# Altium schematic sheet LED_Indicators.SchDoc
size A; SheetNumber: 4; SheetTotal: 4
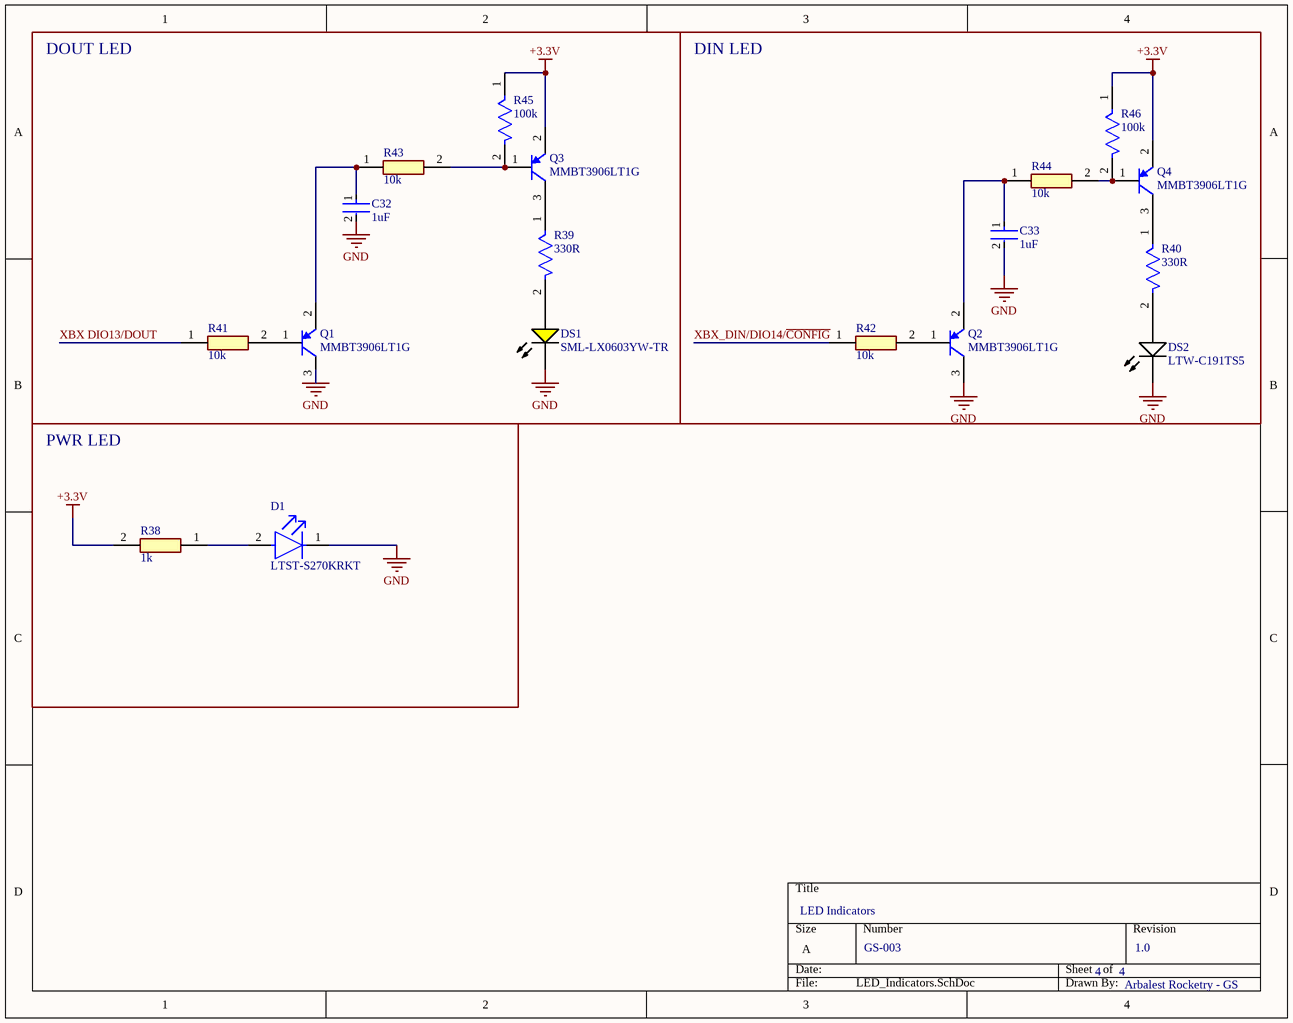
[diagram p0: LED_Indicators.SchDoc]

## Parts
C32  1uF  [FP-0603-L_1_6_0_1-W_0_8_0-IPC_A]
C33  1uF  [FP-0603-L_1_6_0_1-W_0_8_0-IPC_A]
D1  LTST-S270KRKT  [FP-LTST-S270KRKT-MFG]
DS1  SML-LX0603YW-TR  [LUMX-SML-LX0603_V]
DS2  LTW-C191TS5  [LTST-LTW-C191TS5_V]
Q1  MMBT3906LT1G  [ONSC-SOT-23-3-318-08_V]
Q2  MMBT3906LT1G  [ONSC-SOT-23-3-318-08_V]
Q3  MMBT3906LT1G  [ONSC-SOT-23-3-318-08_V]
Q4  MMBT3906LT1G  [ONSC-SOT-23-3-318-08_V]
R38  1k  [RESC1608X55N]
R39  330R  [FP-RMCF0603-MFG]
R40  330R  [FP-RMCF0603-MFG]
R41  10k  [RESC1608X55N]
R42  10k  [RESC1608X55N]
R43  10k  [RESC1608X55N]
R44  10k  [RESC1608X55N]
R45  100k  [FP-MCT0603-IPC_A]
R46  100k  [FP-MCT0603-IPC_A]

## Blocks framed on the sheet
DOUT LED: C32 DS1 Q1 Q3 R39 R41 R43 R45
DIN LED: C33 DS2 Q2 Q4 R40 R42 R44 R46
PWR LED: D1 R38

## Nets
+3.3V: Q3.2(E) Q4.2(E) R38.2 R45.1 R46.1
GND: C32.2 C33.2 D1.1(C) DS1.2(K) DS2.2(K) Q1.3(C) Q2.3(C)
XBX DIO13/DOUT: R41.1
XBX_DIN/DIO14/~{CONFIG}: R42.1
NetC32_1: C32.1 Q1.2(E) R43.1
NetC33_1: C33.1 Q2.2(E) R44.1
NetD1_2: D1.2(A) R38.1
NetDS1_1: DS1.1(A) R39.2
NetDS2_1: DS2.1(A) R40.2
NetQ1_1: Q1.1(B) R41.2
NetQ2_1: Q2.1(B) R42.2
NetQ3_1: Q3.1(B) R43.2 R45.2
NetQ3_3: Q3.3(C) R39.1
NetQ4_1: Q4.1(B) R44.2 R46.2
NetQ4_3: Q4.3(C) R40.1

## Notes on the sheet
- LED Indicators
- GS-003
- 4
- 1.0
- Arbalest Rocketry - GS

## Library data of the parts
C32 C33 = CMP-2000-07259-3: None; Voltage Rating (DC): 25V; Dielectric: X7R; Tolerance: 10%; Height: 0.8mm; Case Code (Metric): 1608; Max Operating Temperature: 125°C; Case Code (Imperial): 0603; Case/Package: 0603; Resistor Type: Ceramic; Halogen Free: Halogen Free; Capacitance: 1uF; Series: M; Voltage Rating: 25V; Number of Pins: 2; Depth: 0.8mm; RoHS Compliant: Yes; Mount: Surface Mount; Min Operating Temperature: -55°C; Length: 1.6mm; Contact Plating: Tin; Radiation Hardening: No; Width: 0.031inch; Construction: Flat; Thickness: 0.035inch; Packaging: Tape and Reel; Termination: SMD/SMT; REACH SVHC: No SVHC; Package Quantity: 1
D1 = CMP-2000-06630-2: LED RED CLEAR CHIP SMD R/A; Test Current: 20mA; Number of LEDs: 1; Power Rating: 75mW; Lens Style: Diffused; Luminous Intensity: 54mcd; Wavelength: 639nm; Dominant Wavelength: 631nm; Lens Color: Colorless; Forward Voltage: 2V; Viewing Angle: 130°; Forward Current: 30mA; Reverse Voltage: 5V; Illumination Color: Red; Case Code (Imperial): 0603; Color: Red; Packaging: Tape and Reel; Number of Pins: 2; Length: 1.6mm; Lens Transparency: Clear; Width: 1.15mm; Power Dissipation: 75mW; Lead Free: Lead Free; Max Power Dissipation: 75mW; Case/Package: 0603; Max Operating Temperature: 85°C; Mount: Surface Mount; Depth: 0.6mm; Number of Elements: 1; Radiation Hardening: No; Case Code (Metric): 1608; Package Quantity: 1; Height: 0.6mm; Min Operating Temperature: -55°C
DS1 = CMP-2000-07121-1: Yellow LED, Milky White Diffused Lens, 2.1 V, 14 mcd, -25 to 85 degC, 2-Pin SMD, RoHS, Tape and Reel; Manufacturer: Lumex; COO: CN; Number of LEDs: 1; Type: Uni-Color; Intensity: 14mcd; Reverse Voltage: 5(Min)V; LED Material: GaAsP; Viewing Angle: 160; Peak Wavelength: 585nm; Pin_Count: 2; Lens Appearance: ColorlessDiffused; Operating Temperature: -25to85C; Color: Yellow; Mounting Technology: SurfaceMount; Package Description: 2-Pin Surface Mount Device, Body 1.6 x 0.8 mm; Mounting: SurfaceMount; Packaging: TapeandReel; RoHS: Unknown; Supplier_Package: SMD; Package Reference: SML-LX00603; Part No: SML-LX0603YW-TR; Datasheet URL: http://www.lumex.com/content/files/ProductAttachment/SML-LX0603YW-TR.pdf; Dimension: 1.6x0.8x0.6mm; Manufacturer URL: http://www.lumexinstruments.com/; HTS: 8541402000; Datasheet Version: Rev. G, 09/2013; Lens Dimensions: 1x0.8x0.3mm; Dominant Wavelength: N/A; ECCN: EARII; Supplier: Lumex; Family: SML-LX0603YW
DS2 = CMP-1674-00013-1: LED Uni-Color White, 70 mW, 20 mA, -20 to 80 degC, 2-Pin SMD, RoHS, Tape and Reel; Case\Package: 0603; Power Rating: 100 mW; Voltage Rating: 50 V; Tolerance: 1%; Resistance: 12 Ohm; Min Operating Temperature: -55 degC; Mount: Surface Mount; Pins: 2; Case Code (Imperial): 0603; PackageReference: LTW-C191TS5; ComponentLink2URL: http://optoelectronics.liteon.com/upload/download/DS22-2004-201/S_110_LTW-C191TS5.pdf; REACH SVHC: No SVHC; Max Operating Temperature: 155 degC; DatasheetVersion: Rev. B, 06/2010; Packaging: Tape and Reel; RoHSCompliant: true; Height: 0.45 mm; Length: 1.6 mm; Width: 0.8 mm; Voltage Rating (DC): 50 V; ComponentLink1URL: http://www.us.liteon.com/; PackageDescription: 2-Pin Surface Mount Device, Body 1.6 x 0.8 mm; ComponentLink1Description: Manufacturer URL; Case Code (Metric): 1608; Package Quantity: 5000; ComponentLink2Description: Datasheet
Q1-Q4 = CMP-1048-00670-1: General Purpose Transistor, PNP Silicon, 3-Pin SOT-23, Pb-Free, Tape and Reel; Manufacturer: On Semiconductor; IC Continuous (A): -0.2; fT Min (MHz): 250; PackageDescription: 3-Pin Small Outline Transistor, Body 2.92 x 1.3 mm, Pitch 0.95 mm; PartNumber: MMBT3906LT1G; Packing: Tape and Reel; ComponentLink3Description: Package Specification; Mounting Technology: Surface Mount; ComponentLink3URL: http://www.onsemi.cn/pub_link/Collateral/318-08.PDF; ComponentLink1URL: http://www.onsemi.com/; ComponentLink2URL: http://www.onsemi.cn/pub_link/Collateral/MMBT3906LT1-D.PDF; PackageReference: SOT-23-3-318-08; Polarity: PNP; ComponentLink2Description: Datasheet; PackageVersion: Rev. AP, 11/2009; RoHS: TRUE; DatasheetVersion: Rev. 11; ComponentLink1Description: Manufacturer URL
R38 = CR0603-JW-102ELF: Resistor; Manufacturer_Name: Bourns; Datasheet Link: https://www.bourns.com/pdfs/chpreztr.pdf; Height: 0.55mm; Manufacturer_Part_Number: CR0603-JW-102ELF; Mouser Part Number: 652-CR0603-JW-102ELF; Mouser Price/Stock: https://www.mouser.co.uk/ProductDetail/Bourns/CR0603-JW-102ELF?qs=rcPhh2wube3o3zlmFZCUPg%3D%3D; Arrow Part Number: CR0603-JW-102ELF; Arrow Price/Stock: https://www.arrow.com/en/products/cr0603-jw-102elf/bourns?region=nac
R39 R40 = CMP-26527-004280-1: 330Ω ±5% 0.1W 0603 Thick Film Chip Resistor AEC-Q200 compliant; Temperature Coefficient: 100ppm/°C; Power Rating: 100mW; Working Voltage: 75V; Radiation Hardening: No; Series: RMCF; Technology: THICK FILM; Construction: Rectangular; Case/Package: 0603; Contact Plating: Tin; Length: 1.55mm; Max Operating Temperature: 155°C; Military Standard: Not; Height: 0.022inch; Case Code (Imperial): 0603; Width: 0.031inch; RoHS Compliant: Yes; Tolerance: 5%; Mount: Surface Mount; Depth: 0.8mm; Case Code (Metric): 1608; Lead Free: Lead Free; Resistor Type: Thick Film; Min Operating Temperature: -55°C; Number of Terminations: 2; Packaging: Tape and Reel; Max Power Dissipation: 100mW; Features: Automotive AEC-Q200; Resistance: 330R
R41-R44 = CR0603-FX-1002ELF: Resistor; Manufacturer_Name: Bourns; Datasheet Link: https://www.bourns.com/pdfs/chpreztr.pdf; Height: 0.55mm; Manufacturer_Part_Number: CR0603-FX-1002ELF; Mouser Part Number: 652-CR0603FX-1002ELF; Mouser Price/Stock: https://www.mouser.co.uk/ProductDetail/Bourns/CR0603-FX-1002ELF?qs=K5ddiUFZPT6XHG0dQH96QA%3D%3D; Arrow Part Number: CR0603-FX-1002ELF; Arrow Price/Stock: https://www.arrow.com/en/products/cr0603-fx-1002elf/bourns?utm_currency=USD&region=europe
R45 R46 = CMP-02407-000782-1: RES SMD 100 OHM 1% 1/8W 0603; Voltage Rating: 75V; Resistance: 100kR; Power Rating: 125mW; Temperature Coefficient: 25ppm/°C; Tolerance: 0.5%; Max Power Dissipation: 150mW; Composition: Thin Film; Packaging: Tape and Reel; Max Operating Temperature: 175°C; Voltage Rating (DC): 75V; Military Standard: Not; Width: 0.033inch; Package Quantity: 1; Depth: 0.85mm; Min Operating Temperature: -55°C; Case Code (Imperial): 0603; Features: Automotive AEC-Q200; Height: 0.022inch; Number of Terminations: 2; Length: 0.061inch; REACH SVHC: No SVHC; Case Code (Metric): 1608; Case/Package: 0603